# Altium project 3u.PrjPcb
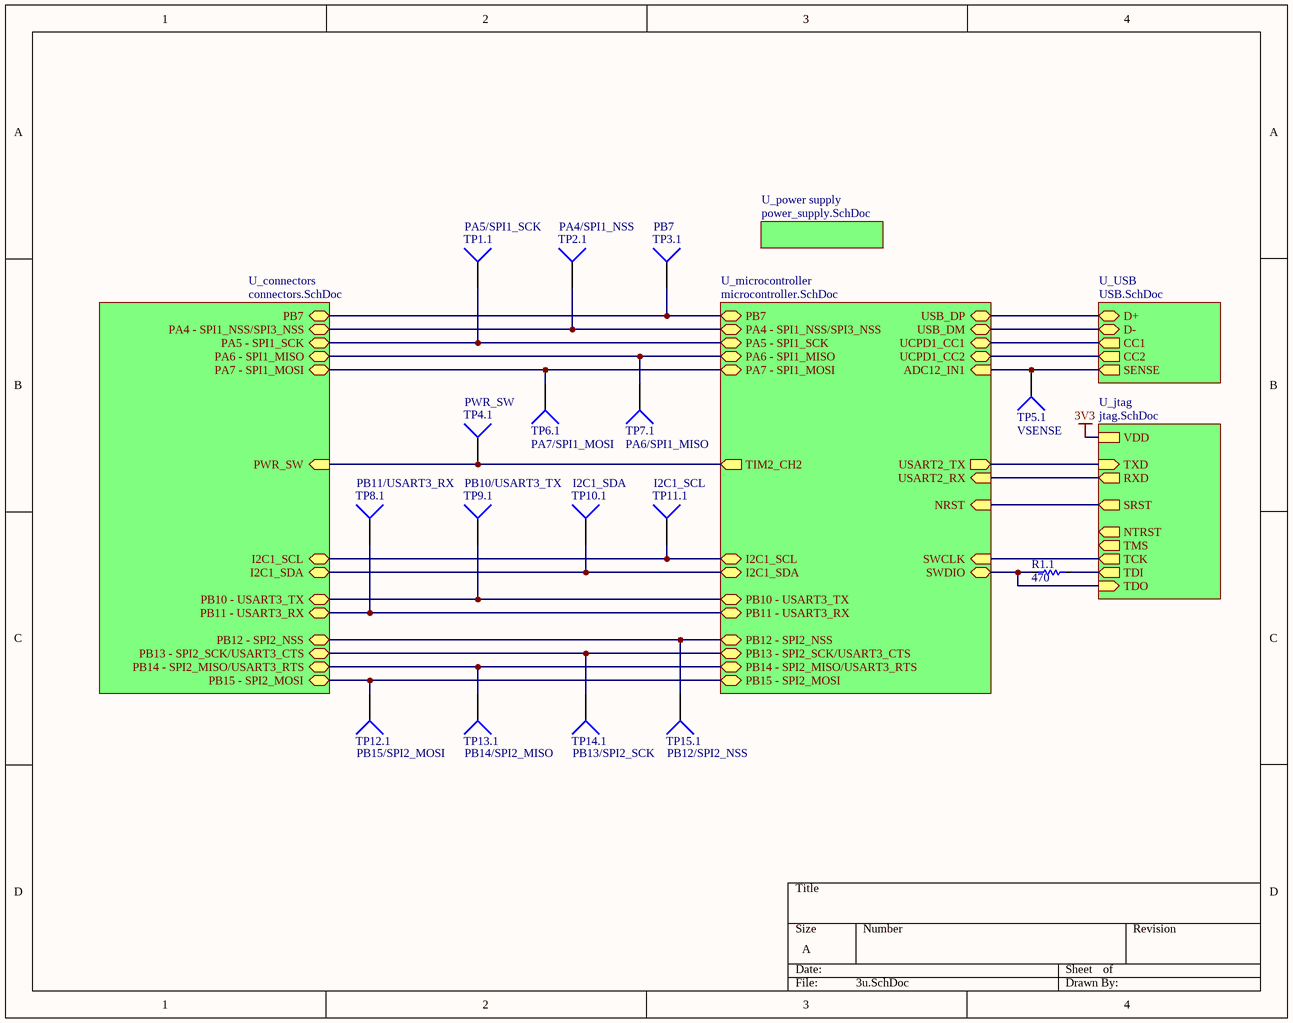
[diagram p0: 3u.SchDoc]
Assembly_Version: 1; PCB_Version: 0.1
7 sheets, 73 parts. Net scope: hierarchical (ports join the sheet entries above them; power ports are global).
Board file: 3u.PcbDoc
Sheets:
  3u.SchDoc
    U_power supply = power_supply.SchDoc
    U_microcontroller = microcontroller.SchDoc
    U_USB = USB.SchDoc
      U_current sensor = current_sensor.SchDoc
    U_jtag = jtag.SchDoc
    U_connectors = connectors.SchDoc

## Sheet 3u.SchDoc
size A

### Parts
R1.1  470  [0402]
TP1.1  PA5/SPI1_SCK  [Test Point Target 1mm]  (no BOM)
TP2.1  PA4/SPI1_NSS  [Test Point Target 1mm]  (no BOM)
TP3.1  PB7  [Test Point Target 1mm]  (no BOM)
TP4.1  PWR_SW  [Test Point Target 1mm]  (no BOM)
TP5.1  VSENSE  [Test Point Target 1mm]  (no BOM)
TP6.1  PA7/SPI1_MOSI  [Test Point Target 1mm]  (no BOM)
TP7.1  PA6/SPI1_MISO  [Test Point Target 1mm]  (no BOM)
TP8.1  PB11/USART3_RX  [Test Point Target 1mm]  (no BOM)
TP9.1  PB10/USART3_TX  [Test Point Target 1mm]  (no BOM)
TP10.1  I2C1_SDA  [Test Point Target 1mm]  (no BOM)
TP11.1  I2C1_SCL  [Test Point Target 1mm]  (no BOM)
TP12.1  PB15/SPI2_MOSI  [Test Point Target 1mm]  (no BOM)
TP13.1  PB14/SPI2_MISO  [Test Point Target 1mm]  (no BOM)
TP14.1  PB13/SPI2_SCK  [Test Point Target 1mm]  (no BOM)
TP15.1  PB12/SPI2_NSS  [Test Point Target 1mm]  (no BOM)

### Sub-sheets
U_connectors = connectors.SchDoc: I2C1_SCL (bidir), PB12 - SPI2_NSS (bidir), PB15 - SPI2_MOSI (bidir), PB7 (bidir), PB10 - USART3_TX (bidir), PB11 - USART3_RX (bidir), PB13 - SPI2_SCK/USART3_CTS (bidir), PA7 - SPI1_MOSI (bidir), PB14 - SPI2_MISO/USART3_RTS (bidir), I2C1_SDA (bidir), PA6 - SPI1_MISO (bidir), PA5 - SPI1_SCK (bidir), PA4 - SPI1_NSS/SPI3_NSS (bidir), PWR_SW (in)
U_jtag = jtag.SchDoc: TDI (out), TMS (out), TCK (out), TDO (in), SRST (out), RXD (out), NTRST (out), TXD (in), VDD
U_microcontroller = microcontroller.SchDoc: NRST (in), I2C1_SDA (bidir), I2C1_SCL (bidir), USART2_TX (out), USART2_RX (in), USB_DM (bidir), USB_DP (bidir), UCPD1_CC1 (bidir), UCPD1_CC2 (bidir), SWDIO (bidir), SWCLK (in), ADC12_IN1 (in), PB11 - USART3_RX (bidir), PB15 - SPI2_MOSI (bidir), PB14 - SPI2_MISO/USART3_RTS (bidir), PB10 - USART3_TX (bidir), PB13 - SPI2_SCK/USART3_CTS (bidir), PB12 - SPI2_NSS (bidir), PA7 - SPI1_MOSI (bidir), PA6 - SPI1_MISO (bidir), PA5 - SPI1_SCK (bidir), PA4 - SPI1_NSS/SPI3_NSS (bidir), PB7 (bidir), TIM2_CH2 (out)
U_power supply = power_supply.SchDoc: no entries
U_USB = USB.SchDoc: D- (bidir), D+ (bidir), CC2 (out), CC1 (out), SENSE (out)

### Nets
I2C1_SCL: TP11.1.1 ; sheet U_microcontroller/I2C1_SCL, sheet U_connectors/I2C1_SCL
I2C1_SDA: TP10.1.1 ; sheet U_microcontroller/I2C1_SDA, sheet U_connectors/I2C1_SDA
UCPD1_CC1: sheet U_microcontroller/UCPD1_CC1, sheet U_USB/CC1
UCPD1_CC2: sheet U_microcontroller/UCPD1_CC2, sheet U_USB/CC2
NetD1.4_4: sheet U_microcontroller/USB_DM, sheet U_USB/D-
NetD1.4_6: sheet U_microcontroller/USB_DP, sheet U_USB/D+
NetP1.3_4: sheet U_microcontroller/SWCLK, sheet U_jtag/TCK
NetP1.3_5: sheet U_microcontroller/USART2_TX, sheet U_jtag/TXD
NetP1.3_6: R1.1.2 ; sheet U_microcontroller/SWDIO, sheet U_jtag/TDO
NetP1.3_8: R1.1.1 ; sheet U_jtag/TDI
NetP1.3_9: sheet U_microcontroller/USART2_RX, sheet U_jtag/RXD
NetP1.3_10: sheet U_microcontroller/NRST, sheet U_jtag/SRST
NetP1.7_3: TP3.1.1 ; sheet U_microcontroller/PB7, sheet U_connectors/PB7
NetP1.7_4: TP2.1.1 ; sheet U_microcontroller/PA4 - SPI1_NSS/SPI3_NSS, sheet U_connectors/PA4 - SPI1_NSS/SPI3_NSS
NetP1.7_8: TP1.1.1 ; sheet U_microcontroller/PA5 - SPI1_SCK, sheet U_connectors/PA5 - SPI1_SCK
NetP1.7_12: TP7.1.1 ; sheet U_microcontroller/PA6 - SPI1_MISO, sheet U_connectors/PA6 - SPI1_MISO
NetP1.7_13: TP6.1.1 ; sheet U_microcontroller/PA7 - SPI1_MOSI, sheet U_connectors/PA7 - SPI1_MOSI
NetP2.7_6: TP9.1.1 ; sheet U_microcontroller/PB10 - USART3_TX, sheet U_connectors/PB10 - USART3_TX
NetP2.7_7: TP8.1.1 ; sheet U_microcontroller/PB11 - USART3_RX, sheet U_connectors/PB11 - USART3_RX
NetP2.7_9: TP15.1.1 ; sheet U_microcontroller/PB12 - SPI2_NSS, sheet U_connectors/PB12 - SPI2_NSS
NetP2.7_10: TP14.1.1 ; sheet U_microcontroller/PB13 - SPI2_SCK/USART3_CTS, sheet U_connectors/PB13 - SPI2_SCK/USART3_CTS
NetP2.7_13: TP13.1.1 ; sheet U_microcontroller/PB14 - SPI2_MISO/USART3_RTS, sheet U_connectors/PB14 - SPI2_MISO/USART3_RTS
NetP2.7_14: TP12.1.1 ; sheet U_microcontroller/PB15 - SPI2_MOSI, sheet U_connectors/PB15 - SPI2_MOSI
NetQ2.7_3: TP4.1.1 ; sheet U_microcontroller/TIM2_CH2, sheet U_connectors/PWR_SW
NetTP5.1_1: TP5.1.1 ; sheet U_microcontroller/ADC12_IN1, sheet U_USB/SENSE

### Library data of the parts
R1.1 = RESISTOR: Value: 470
TP1.1 TP2.1 TP3.1 TP4.1 TP5.1 TP6.1 TP7.1 TP8.1 TP9.1 TP10.1 TP11.1 TP12.1 TP13.1 TP14.1 TP15.1 = Socket: LatestRevisionDate: 17-Jul-2002; LatestRevisionNote: Re-released for DXP Platform.; Publisher: Altium Limited

## Sheet power_supply.SchDoc
size A
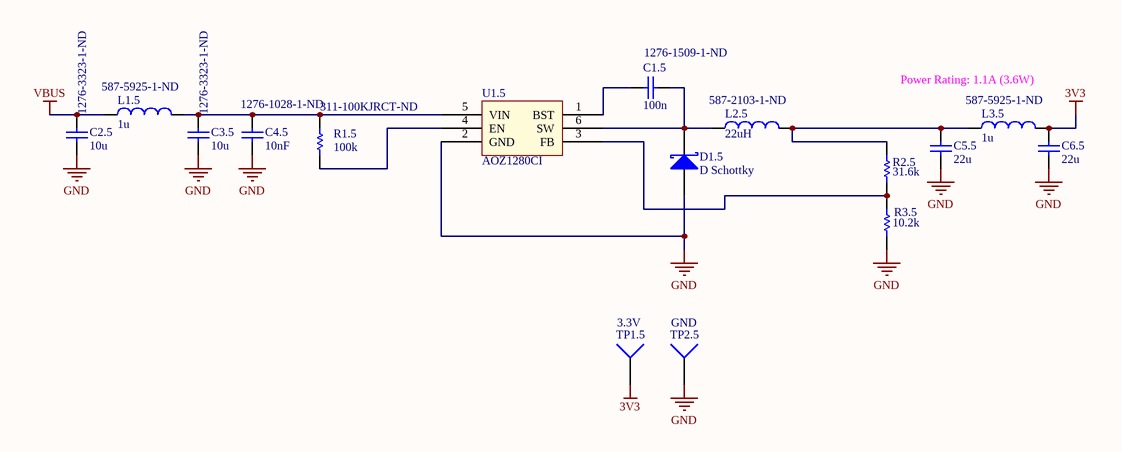
[diagram p1: power_supply.SchDoc]

### Parts
C1.5  Supplier Part Number 1: 1276-1509-1-ND  [0402]  (hidden comment: 100n)
C2.5  Supplier Part Number 1: 1276-3323-1-ND  [1210]  (hidden comment: 10u)
C3.5  Supplier Part Number 1: 1276-3323-1-ND  [1210]  (hidden comment: 10u)
C4.5  Supplier Part Number 1: 1276-1028-1-ND  [0402]  (hidden comment: 10nF)
C5.5  22u  [0805]
C6.5  22u  [0805]
D1.5  D Schottky  [DO-214AC]
L1.5  Supplier Part Number 1: 587-5925-1-ND  [0806]  (hidden comment: 1u)
L2.5  value 22uH  Supplier Part Number 1: 587-2103-1-ND  [Murata 2900]  (hidden comment: 33u)
L3.5  Supplier Part Number 1: 587-5925-1-ND  [0806]  (hidden comment: 1u)
R1.5  Supplier Part Number 1: 311-100KJRCT-ND  [0402]  (hidden comment: 100k)
R2.5  value 31.6k  [0402]  (hidden comment: 9.09k)
R3.5  value 10.2k  [0402]  (hidden comment: 9.09k)
TP1.5  3.3V  [Test Point Target 1mm]  (no BOM)
TP2.5  GND  [Test Point Target 1mm]  (no BOM)
U1.5  Manufacturer Part Number: AOZ1280CI  [MK06A_N]

### Nets
3V3: C6.5.2 L3.5.2 TP1.5.1
GND: C2.5.1 C3.5.1 C4.5.1 C5.5.1 C6.5.1 D1.5.A R3.5.1 TP2.5.1 U1.5.2(GND)
VBUS: C2.5.2 L1.5.1
NetC1.5_1: C1.5.1 U1.5.1(BST)
NetC1.5_2: C1.5.2 D1.5.K L2.5.1 U1.5.6(SW)
NetC3.5_2: C3.5.2 C4.5.2 L1.5.2 R1.5.2 U1.5.5(VIN)
NetC5.5_2: C5.5.2 L2.5.2 L3.5.1 R2.5.2
NetR1.5_1: R1.5.1 U1.5.4(EN)
NetR2.5_1: R2.5.1 R3.5.2 U1.5.3(FB)

### Notes on the sheet
- Power Rating: 1.1A (3.6W)

### Library data of the parts
C1.5 C4.5 = CAPACITOR NON_POL: Supplier 1: Digi-Key
  C1.5: Value: 100n
  C4.5: Value: 10nF
C2.5 C3.5 = CAPACITOR NON_POL: Material: Ceramic; Capacitance: 10uF; Tolerance: 10%; Dielectric: X7R; Voltage Rating: 35V; Value: 10u; ComponentLink1URL: http://www.murata.com/~/media/webrenewal/support/library/catalog/products/capacitor/mlcc/c02e.ashx; ComponentLink1Description: http://www.murata.com/~/media/webrenewal/support/library/catalog/products/capacitor/mlcc/c02e.ashx; Supplier 1: Digi-Key; Stock 1: 421732; Pricing 1: 1 = 0.81000, 10 = 0.57000, 100 = 0.37510, 500 = 0.27788, 1000 = 0.23619 (USD); RoHS: Yes; Mount: Surface Mount; Case/Package: 1210; Case Code (Metric): 3225; Case Code (Imperial): 1210; Min Operating Temperature: -55°C; Max Operating Temperature: 125°C; Package Quantity: 1; Packaging: Tape and Reel; Voltage: 35V; Length: 3.2mm; Height: 1.8mm; Depth: 2.5mm; Width: 0.098inch; Thickness: 0.079inch; Radiation Hardening: No; Lead Free: Lead Free; ComponentLink2URL: https://datasheet.ciiva.com/25724/cl32b106klulnne-25724000.pdf?src-supplier=Digi-Key; ComponentLink2Description: https://datasheet.ciiva.com/25724/cl32b106klulnne-25724000.pdf?src-supplier=Digi-Key; ComponentLink3URL: https://datasheet.ciiva.com/15196/getdatasheetpartid-353216-15196149.pdf?src-supplier=Verical; ComponentLink3Description: https://datasheet.ciiva.com/15196/getdatasheetpartid-353216-15196149.pdf?src-supplier=Verical; ComponentLink4URL: https://datasheet.ciiva.com/29202/450840-da-01-en-vs-kondensator-1210-29202828.pdf?src-supplier=Conrad; ComponentLink4Description: https://datasheet.ciiva.com/29202/450840-da-01-en-vs-kondensator-1210-29202828.pdf?src-supplier=Conrad
C5.5 C6.5 = CAPACITOR NON_POL: Manufacturer: Murata Electronics North America; Manufacturer Part Number: GRM21BR61A226ME44L; Capacitance: 22µF; Tolerance: ±20%; Voltage - Rated: 10V; Temperature Coefficient: X5R; Value: 22u; Supplier 1: Digi-Key; Supplier Part Number 1: 490-10746-1-ND; RoHS: RoHS Compliant; Category: Capacitors; Stock 1: 23435; Pricing 1: 1=0.48, 10=0.34, 100=0.2237, 1000=0.14082 (USD); Packaging: Cut Tape (CT); Part Status: Active; Operating Temperature: -55°C ~ 85°C; Features: -; Ratings: -; Applications: General Purpose; Mounting Type: Surface Mount, MLCC; Package / Case: 0805 (2012 Metric); Size / Dimension: 0.079" L x 0.049" W (2.00mm x 1.25mm); Height - Seated (Max): -; Thickness (Max): 0.057" (1.45mm); Lead Spacing: -; Lead Style: -; ComponentLink1URL: http://www.murata.com/~/media/webrenewal/support/library/catalog/products/capacitor/mlcc/c02e.ashx; ComponentLink1Description: http://www.murata.com/~/media/webrenewal/support/library/catalog/products/capacitor/mlcc/c02e.ashx
D1.5 = D Schottky: Schottky Diode; Manufacturer: Diodes Incorporated; Manufacturer Part Number: B240A-13-F; Current - Average Rectified (Io): 2A; Speed: Fast Recovery =< 500ns, > 200mA (Io); Capacitance @ Vr, F: 200pF @ 4V, 1MHz; Supplier 1: Digi-Key; Supplier Part Number 1: B240A-FDICT-ND; RoHS: RoHS Compliant; Category: Discrete Semiconductor Products; Stock 1: 244420; Pricing 1: 1=0.5, 10=0.38, 100=0.2368, 500=0.16202, 1000=0.12463 (USD); Packaging: Cut Tape (CT); Part Status: Active; Diode Type: Schottky; Mounting Type: Surface Mount; Package / Case: DO-214AC, SMA; Supplier Device Package: SMA; Operating Temperature - Junction: -65°C ~ 150°C; Base Part Number: B240; ComponentLink1URL: https://www.diodes.com/assets/Datasheets/ds13004.pdf; ComponentLink1Description: https://www.diodes.com/assets/Datasheets/ds13004.pdf
L1.5 L3.5 = Inductor: Manufacturer: Taiyo Yuden; Manufacturer Part Number: MAKK2016T1R0M; Type: Wirewound; Material - Core: Metal; Tolerance: ±20%; Current - Saturation: 2.2A; Shielding: Shielded; DC Resistance (DCR): 75 mOhm Max; Value: 1u; Supplier 1: Digi-Key; RoHS: RoHS Compliant; Category: Inductors, Coils, Chokes; Stock 1: 39611; Pricing 1: 1=0.23, 10=0.204, 100=0.1404, 500=0.12, 1000=0.09191 (USD); Packaging: Cut Tape (CT); Part Status: Active; Q @ Freq: -; Frequency - Self Resonant: -; Ratings: -; Operating Temperature: -40°C ~ 105°C; Mounting Type: Surface Mount; Package / Case: 0806 (2016 Metric); Supplier Device Package: 0806 (2016 Metric); Size / Dimension: 0.079" L x 0.063" W (2.00mm x 1.60mm); Height - Seated (Max): 0.039" (1.00mm); ComponentLink1URL: http://ds.yuden.co.jp/TYCOMPAS/ut/detail.do?productNo=MAKK2016T1R0M&fileName=MAKK2016T1R0M_SS&mode=specSheetDownload; ComponentLink1Description: http://ds.yuden.co.jp/TYCOMPAS/ut/detail.do?productNo=MAKK2016T1R0M&fileName=MAKK2016T1R0M_SS&mode=specSheetDownload
L2.5 = Inductor: Manufacturer: Murata Power Solutions Inc; Manufacturer Part Number: 29L104C; Code_IEC: 1005; Inductance: 100µH; Current: 480mA; Shielding: Shielded; DC Resistance (DCR): 456.0 mOhm Max; Frequency - Test: 10kHz; Current - Saturation: 1.1A; Current - Temperature Rise: 1.3A; Frequency - Self Resonant: 11MHz; Published: 8-Jun-2000; LatestRevisionDate: 29-May-2009; LatestRevisionNote: IPC-7351 Footprint Added.; PackageReference: 0402-A; Publisher: Altium Limited; PackageDescription: Chip Inductor; Code_JEITA: 0402; RoHS: RoHS Compliant; Category: Inductors, Coils, Chokes; Current Rating - Saturation: -; Current Rating - Temperature Rise: -; Type: -; Tolerance: -; Q @ Freq: -; Self Resonant Freq: -; Package / Case: 0.283" L x 0.283" W x 0.124" H (7.20mm x 7.20mm x 3.15mm); Mounting Type: Surface Mount; Packaging: Digi-Reel®; Operating Temperature: -40°C ~ 85°C; Core Material: -; Applications: EMI Filter; ComponentLink1URL: http://www.murata-ps.com/data/magnetics/kmp_2900l.pdf; ComponentLink1Description: http://www.murata-ps.com/data/magnetics/kmp_2900l.pdf; Material - Core: -; ComponentLink2URL: http://www.yuden.co.jp/ut/product/pdf/wound_i_all_e.pdf; ComponentLink2Description: http://www.yuden.co.jp/ut/product/pdf/wound_i_all_e.pdf; Supplier 1: Digi-Key; Stock 1: 12480; Pricing 1: 1=0.34, 10=0.316, 50=0.2962, 100=0.2765, 500=0.21726, 1000=0.17775, 2000=0.1185, 4000=0.11455, 6000=0.1106, 8000=0.10665, 10000=0.10152, 12000=0.09638 (USD); ComponentLink3URL: http://www.yuden.co.jp/cs/release/pdf/pdf_480.pdf; ComponentLink3Description: http://www.yuden.co.jp/cs/release/pdf/pdf_480.pdf
R1.5 = ERJ2GE: Value: 100k; Supplier 1: Digi-Key
R2.5 = ERJ2GE: Resistor; Manufacturer: Susumu; Manufacturer Part Number: RR0510P-3322-D; Note: If flow soldering, adjust pad width of PCB Footprint to 0.7 - 0.8 times the width of the resistor.; Resistance (Ohms): 33.2K; Power (Watts): 0.063W, 1/16W; Temperature Coefficient: ±25ppm/°C; Tolerance: ±0.5%; Published: 17-Dec-2003; LatestRevisionDate: 19-Mar-2004; LatestRevisionNote: Silkscreen size reduced.; PackageDocument: Mar-2003; PackageReference: 2-0402; Publisher: Altium Limited; Code_IPC: 1005 [0402]; ComponentLink1Description: Manufacturer Link; ComponentLink1URL: http://www.panasonic.com/industrial/components/resistive_products.htm; ComponentLink2Description: Datasheet; ComponentLink2URL: http://www.panasonic.com/industrial/components/pdf/AOA0000CE1.pdf; RoHS: RoHS Compliant; Composition: Thin Film; Features: -; Size / Dimension: 0.039" L x 0.020" W (1.00mm x 0.50mm); Height: 0.016" (0.40mm); Number of Terminations: 2; Packaging: Cut Tape (CT); Package / Case: 0402 (1005 Metric); ComponentLink3URL: http://www.susumu-usa.com/pdf/products_12.pdf; ComponentLink3Description: http://www.susumu-usa.com/pdf/products_12.pdf; Supplier 1: Digi-Key; Supplier Part Number 1: RMCF0402FT31K6CT-ND; Stock 1: 54086; Pricing 1: 1=0.04, 10=0.025, 50=0.0138, 100=0.0105, 250=0.0078, 500=0.00576, 1000=0.00384 (USD); ComponentLink4URL: http://www.seielect.com/Catalog/SEI-RMCF.pdf; ComponentLink4Description: http://www.seielect.com/Catalog/SEI-RMCF.pdf
R3.5 = ERJ2GE: Resistor; Manufacturer: Stackpole Electronics Inc; Manufacturer Part Number: RMCF0402FT14K3; Note: If flow soldering, adjust pad width of PCB Footprint to 0.7 - 0.8 times the width of the resistor.; Resistance (Ohms): 14.3K; Power (Watts): 0.063W, 1/16W; Temperature Coefficient: ±100ppm/°C; Tolerance: ±1%; Published: 17-Dec-2003; LatestRevisionDate: 19-Mar-2004; LatestRevisionNote: Silkscreen size reduced.; PackageDocument: Mar-2003; PackageReference: 2-0402; Publisher: Altium Limited; Code_IPC: 1005 [0402]; ComponentLink1Description: Manufacturer Link; ComponentLink1URL: http://www.panasonic.com/industrial/components/resistive_products.htm; ComponentLink2Description: Datasheet; ComponentLink2URL: http://www.panasonic.com/industrial/components/pdf/AOA0000CE1.pdf; RoHS: RoHS Compliant; Composition: Thick Film; Features: -; Size / Dimension: 0.039" L x 0.020" W (1.00mm x 0.50mm); Height: 0.016" (0.40mm); Number of Terminations: 2; Packaging: Cut Tape (CT); Package / Case: 0402 (1005 Metric); ComponentLink3URL: http://www.seielect.com/Catalog/SEI-RMCF.pdf; ComponentLink3Description: http://www.seielect.com/Catalog/SEI-RMCF.pdf; Supplier 1: Digi-Key; Supplier Part Number 1: RMCF0402FT10K2CT-ND; Stock 1: 8430; Pricing 1: 1=0.04, 10=0.025, 50=0.0138, 100=0.0105, 250=0.0078, 500=0.00576, 1000=0.00384 (USD)
TP1.5 TP2.5 = Socket: LatestRevisionDate: 17-Jul-2002; LatestRevisionNote: Re-released for DXP Platform.; Publisher: Altium Limited
U1.5 = ADP2300: IC BUCK ADJ 1.2A 6TSOT; Manufacturer: Alpha & Omega Semiconductor Inc.; Function: Step-Down; Output Configuration: Positive; Output Type: Adjustable; Number of Outputs: 1; Voltage - Input (Min): 3V; Voltage - Input (Max): 26V; Voltage - Output (Min/Fixed): 0.8V; Frequency - Switching: 1.5MHz; Synchronous Rectifier: No; Supplier 1: Digi-Key; Supplier Part Number 1: 785-1277-1-ND; RoHS: RoHS Compliant; Category: Integrated Circuits (ICs); Stock 1: 404776; Pricing 1: 1=0.7, 10=0.613, 25=0.5428, 100=0.4728, 250=0.41148, 500=0.3502, 1000=0.28016 (USD); Packaging: Cut Tape (CT); Part Status: Active; Topology: Buck; Voltage - Output (Max): 26V; Current - Output: 1.2A; Operating Temperature: -40°C ~ 85°C (TA); Mounting Type: Surface Mount; Package / Case: SOT-23-6; Supplier Device Package: SOT-23-6; ComponentLink1URL: http://aosmd.com/res/data_sheets/AOZ1280CI.pdf; ComponentLink1Description: http://aosmd.com/res/data_sheets/AOZ1280CI.pdf

## Sheet microcontroller.SchDoc
size A
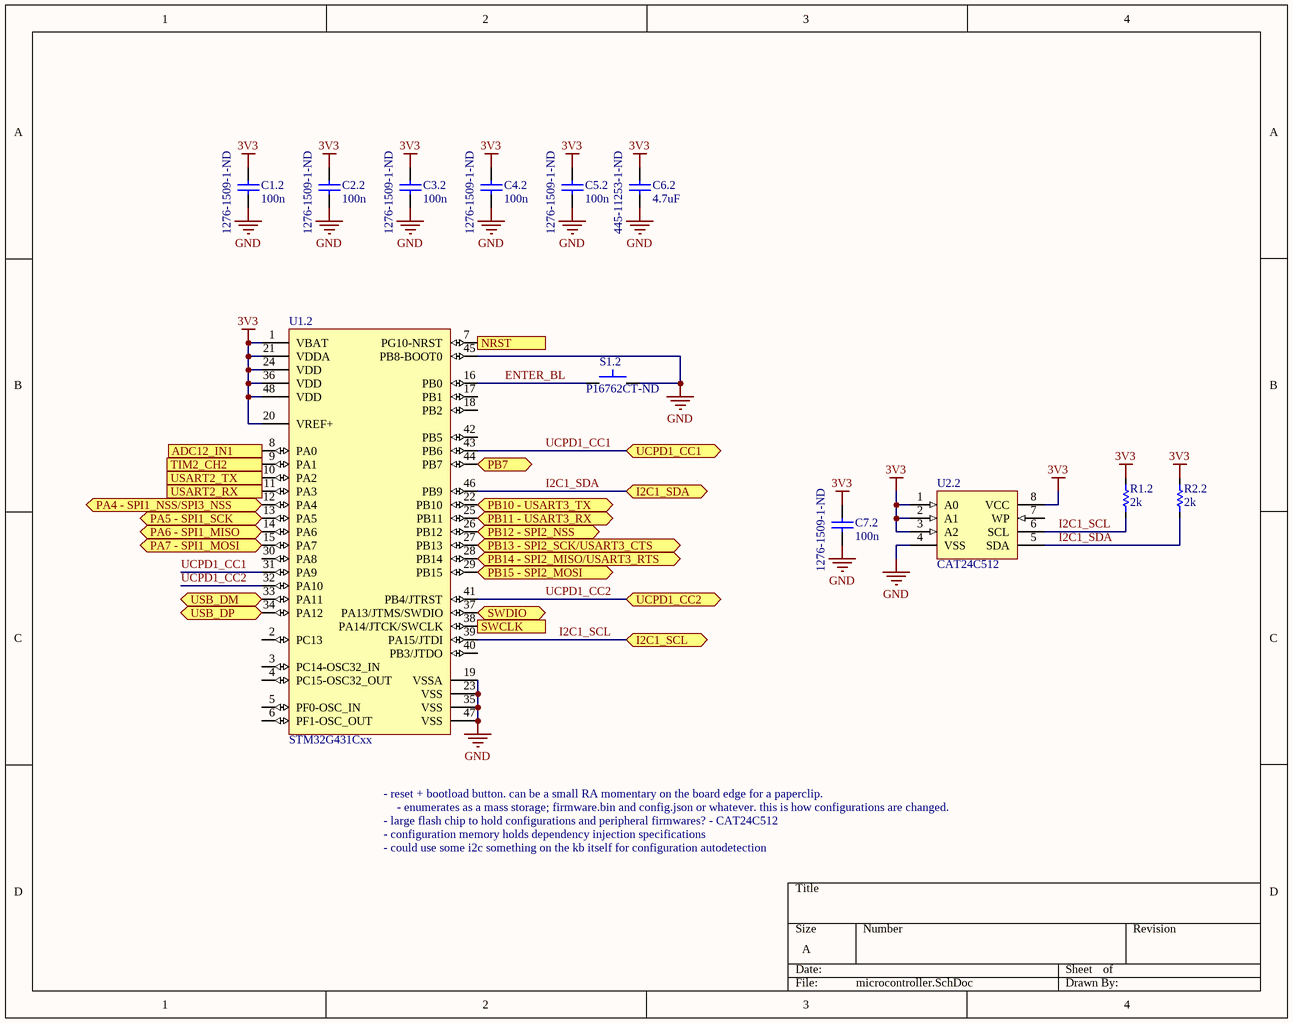
[diagram p2: microcontroller.SchDoc]

### Parts
C1.2  Supplier Part Number 1: 1276-1509-1-ND  [0402]  (hidden comment: 100n)
C2.2  Supplier Part Number 1: 1276-1509-1-ND  [0402]  (hidden comment: 100n)
C3.2  Supplier Part Number 1: 1276-1509-1-ND  [0402]  (hidden comment: 100n)
C4.2  Supplier Part Number 1: 1276-1509-1-ND  [0402]  (hidden comment: 100n)
C5.2  Supplier Part Number 1: 1276-1509-1-ND  [0402]  (hidden comment: 100n)
C6.2  4.7uF  Supplier Part Number 1: 445-11253-1-ND  [1608[0603]]
C7.2  Supplier Part Number 1: 1276-1509-1-ND  [0402]  (hidden comment: 100n)
R1.2  2k  [0402]
R2.2  2k  [0402]
S1.2  Supplier Part Number 1: P16762CT-ND  [EVQ-P6D/P]  (hidden comment: MOM_SWITCH)
U1.2  STM32G431Cxx  [TSQFP50P900X900X160-48N]
U2.2  CAT24C512  [TSOP65P640X120-8N]

### Ports
ADC12_IN1 (in), I2C1_SCL (bidir), I2C1_SDA (bidir), NRST (in), PA4 - SPI1_NSS/SPI3_NSS (bidir), PA5 - SPI1_SCK (bidir), PA6 - SPI1_MISO (bidir), PA7 - SPI1_MOSI (bidir), PB7 (bidir), PB10 - USART3_TX (bidir), PB11 - USART3_RX (bidir), PB12 - SPI2_NSS (bidir), PB13 - SPI2_SCK/USART3_CTS (bidir), PB14 - SPI2_MISO/USART3_RTS (bidir), PB15 - SPI2_MOSI (bidir), SWCLK (in), SWDIO (bidir), TIM2_CH2 (out), UCPD1_CC1 (bidir), UCPD1_CC2 (bidir), USART2_RX (in), USART2_TX (out), USB_DM (bidir), USB_DP (bidir)

### Nets
3V3: C1.2.1 C2.2.1 C3.2.1 C4.2.1 C5.2.1 C6.2.2 C7.2.1 R1.2.2 R2.2.2 U1.2.1(VBAT) U1.2.20(VREF+) U1.2.21(VDDA) U1.2.24(VDD) U1.2.36(VDD) U1.2.48(VDD) U2.2.1(A0) U2.2.2(A1) U2.2.3(A2) U2.2.8(VCC)
GND: C1.2.2 C2.2.2 C3.2.2 C4.2.2 C5.2.2 C6.2.1 C7.2.2 S1.2.2 U1.2.19(VSSA) U1.2.23(VSS) U1.2.35(VSS) U1.2.45(PB8-BOOT0) U1.2.47(VSS) U2.2.4(VSS)
ENTER_BL: S1.2.1 U1.2.16(PB0)
I2C1_SCL: R1.2.1 U1.2.39(PA15/JTDI) U2.2.6(SCL) ; port I2C1_SCL
I2C1_SDA: R2.2.1 U1.2.46(PB9) U2.2.5(SDA) ; port I2C1_SDA
UCPD1_CC1: U1.2.31(PA9) U1.2.43(PB6) ; port UCPD1_CC1
UCPD1_CC2: U1.2.32(PA10) U1.2.41(PB4/JTRST) ; port UCPD1_CC2
NetD1.4_4: U1.2.33(PA11) ; port USB_DM
NetD1.4_6: U1.2.34(PA12) ; port USB_DP
NetP1.3_4: U1.2.38(PA14/JTCK/SWCLK) ; port SWCLK
NetP1.3_5: U1.2.10(PA2) ; port USART2_TX
NetP1.3_6: U1.2.37(PA13/JTMS/SWDIO) ; port SWDIO
NetP1.3_9: U1.2.11(PA3) ; port USART2_RX
NetP1.3_10: U1.2.7(PG10-NRST) ; port NRST
NetP1.7_3: U1.2.44(PB7) ; port PB7
NetP1.7_4: U1.2.12(PA4) ; port PA4 - SPI1_NSS/SPI3_NSS
NetP1.7_8: U1.2.13(PA5) ; port PA5 - SPI1_SCK
NetP1.7_12: U1.2.14(PA6) ; port PA6 - SPI1_MISO
NetP1.7_13: U1.2.15(PA7) ; port PA7 - SPI1_MOSI
NetP2.7_6: U1.2.22(PB10) ; port PB10 - USART3_TX
NetP2.7_7: U1.2.25(PB11) ; port PB11 - USART3_RX
NetP2.7_9: U1.2.26(PB12) ; port PB12 - SPI2_NSS
NetP2.7_10: U1.2.27(PB13) ; port PB13 - SPI2_SCK/USART3_CTS
NetP2.7_13: U1.2.28(PB14) ; port PB14 - SPI2_MISO/USART3_RTS
NetP2.7_14: U1.2.29(PB15) ; port PB15 - SPI2_MOSI
NetQ2.7_3: U1.2.9(PA1) ; port TIM2_CH2
NetTP5.1_1: U1.2.8(PA0) ; port ADC12_IN1

Not connected (* = marked no-connect by the designer): U1.2 2(PC13) 3(PC14-OSC32_IN) 4(PC15-OSC32_OUT) 5(PF0-OSC_IN) 6(PF1-OSC_OUT) 17(PB1) 18(PB2) 30(PA8) 40(PB3/JTDO) 42(PB5); U2.2 7(WP)

### Notes on the sheet
- - reset + bootload button. can be a small RA momentary on the board edge for a paperclip.
- - large flash chip to hold configurations and peripheral firmwares? - CAT24C512
- - configuration memory holds dependency injection specifications
- - enumerates as a mass storage; firmware.bin and config.json or whatever. this is how configurations are changed.
- - could use some i2c something on the kb itself for configuration autodetection

### Library data of the parts
C1.2 C2.2 C3.2 C4.2 C5.2 C7.2 = CAPACITOR NON_POL: Value: 100n; Supplier 1: Digi-Key
C6.2 = C0402: Value: 4.7uF; Supplier 1: Digi-Key
R1.2 R2.2 = RESISTOR: Manufacturer: Yageo; Manufacturer Part Number: RC0402JR-072KL; Tolerance: ±5%; Power (Watts): 0.063W, 1/16W; Temperature Coefficient: ±100ppm/°C; Value: 2k; Supplier 1: Digi-Key; Supplier Part Number 1: 311-2.0KJRCT-ND; Pricing 1: 1=0.1, 10=0.012, 25=0.0084, 100=0.0047, 250=0.0036, 500=0.0029, 1000=0.00213, 2500=0.00185, 5000=0.00153 (USD); Packaging: Cut Tape (CT); Resistance (Ohms): 2k; Composition: Thick Film; Features: Moisture Resistant; Operating Temperature: -55°C ~ 155°C; Package / Case: 0402 (1005 Metric); Supplier Device Package: 0402; Size / Dimension: 0.039" L x 0.020" W (1.00mm x 0.50mm); Height: 0.016" (0.40mm); Number of Terminations: 2; ComponentLink1URL: http://www.yageo.com/documents/recent/PYu-RC_Group_51_RoHS_L_04.pdf; ComponentLink1Description: http://www.yageo.com/documents/recent/PYu-RC_Group_51_RoHS_L_04.pdf
S1.2 = MOM_SWITCH: Momentary switch; Supplier 1: Digi-Key

## Sheet USB.SchDoc
size A
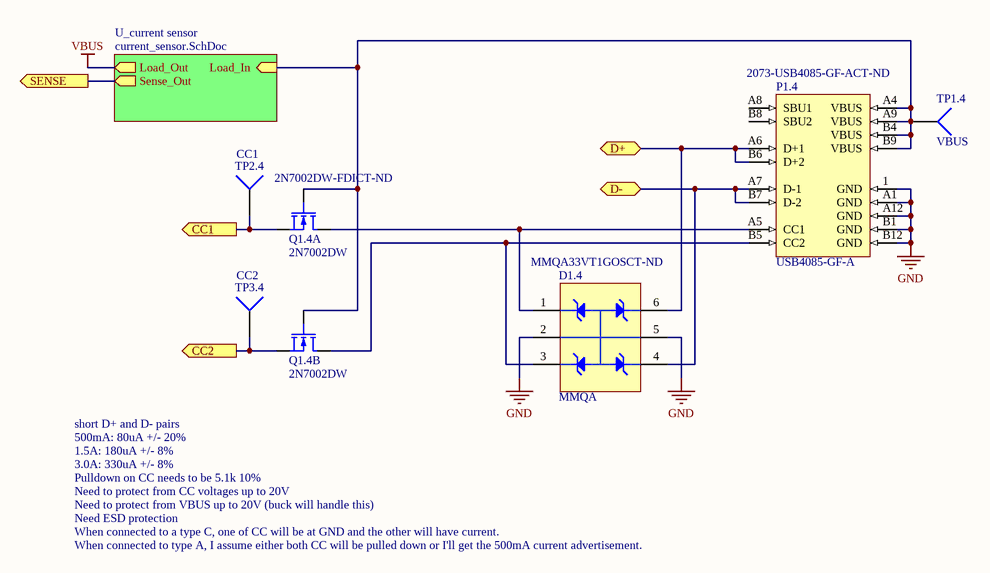
[diagram p3: USB.SchDoc]

### Parts
D1.4  MMQA  Supplier Part Number 1: MMQA33VT1GOSCT-ND  [SC-74]
P1.4  USB4085-GF-A  Supplier Part Number 1: 2073-USB4085-GF-ACT-ND  [USB4085-GF-A]
Q1.4  2N7002DW  Supplier Part Number 1: 2N7002DW-FDICT-ND  [SOT65P210X110-6N]  (parts A,B of 2)
TP1.4  VBUS  [Test Point Target 1mm]  (no BOM)
TP2.4  CC1  [Test Point Target 1mm]  (no BOM)
TP3.4  CC2  [Test Point Target 1mm]  (no BOM)

### Sub-sheets
U_current sensor = current_sensor.SchDoc: Load_In (in), Load_Out (out), Sense_Out (out)

### Ports
CC1 (out), CC2 (out), D+ (bidir), D- (bidir), SENSE (out)

### Nets
GND: D1.4.2 D1.4.5 P1.4.1(GND) P1.4.A1(GND) P1.4.A12(GND) P1.4.B1(GND) P1.4.B12(GND)
UCPD1_CC1: Q1.4.4(S) TP2.4.1 ; port CC1
UCPD1_CC2: Q1.4.1(S) TP3.4.1 ; port CC2
NetD1.4_1: D1.4.1 P1.4.A5(CC1) Q1.4.3(D)
NetD1.4_3: D1.4.3 P1.4.B5(CC2) Q1.4.6(D)
NetD1.4_4: D1.4.4 P1.4.A7(D-1) P1.4.B7(D-2) ; port D-
NetD1.4_6: D1.4.6 P1.4.A6(D+1) P1.4.B6(D+2) ; port D+
NetP1.4_A4: P1.4.A4(VBUS) P1.4.A9(VBUS) P1.4.B4(VBUS) P1.4.B9(VBUS) Q1.4.2(G) Q1.4.5(G) TP1.4.1 ; sheet U_current sensor/Load_In
NetTP5.1_1: port SENSE, sheet U_current sensor/Sense_Out

Not connected (* = marked no-connect by the designer): P1.4 A8(SBU1) B8(SBU2)

### Notes on the sheet
- short D+ and D- pairs
- Need to protect from CC voltages up to 20V
- 500mA: 80uA +/- 20%
- 1.5A: 180uA +/- 8%
- 3.0A: 330uA +/- 8%
- Pulldown on CC needs to be 5.1k 10%
- Need to protect from VBUS up to 20V (buck will handle this)
- When connected to a type C, one of CC will be at GND and the other will have current.
- When connected to type A, I assume either both CC will be pulled down or I'll get the 500mA current advertisement.
- Need ESD protection

### Library data of the parts
P1.4 = USB4085-GF-A: USB C Connector; Supplier 1: Digi-Key
TP1.4 TP2.4 TP3.4 = Socket: LatestRevisionDate: 17-Jul-2002; LatestRevisionNote: Re-released for DXP Platform.; Publisher: Altium Limited
D1.4 = MMQA: Supplier 1: Digi-Key
Q1.4 = 2N7002DW: Supplier 1: Digi-Key

## Sheet current_sensor.SchDoc
size A
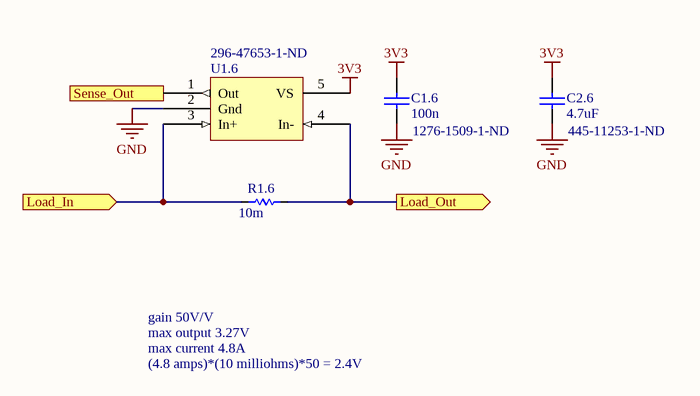
[diagram p4: current_sensor.SchDoc]

### Parts
C1.6  Supplier Part Number 1: 1276-1509-1-ND  [0402]  (hidden comment: 100n)
C2.6  4.7uF  Supplier Part Number 1: 445-11253-1-ND  [1608[0603]]
R1.6  10m  [0805]
U1.6  Supplier Part Number 1: 296-47653-1-ND  [SOT23-5]

### Ports
Load_In (in), Load_Out (out), Sense_Out (out)

### Nets
3V3: C1.6.1 C2.6.2 U1.6.5(VS)
GND: C1.6.2 C2.6.1 U1.6.2(Gnd)
VBUS: R1.6.1 U1.6.4(In-) ; port Load_Out
NetP1.4_A4: R1.6.2 U1.6.3(In+) ; port Load_In
NetTP5.1_1: U1.6.1(Out) ; port Sense_Out

### Notes on the sheet
- gain 50V/V
- max output 3.27V
- max current 4.8A
- (4.8 amps)*(10 milliohms)*50 = 2.4V

### Library data of the parts
C1.6 = CAPACITOR NON_POL: Value: 100n; Supplier 1: Digi-Key
C2.6 = C0402: derates to 2.2; Value: 4.7uF; Supplier 1: Digi-Key
R1.6 = RESISTOR: ComponentLink1URL: http://www.susumu.co.jp/common/pdf/n_catalog_partition09_en.pdf; ComponentLink1Description: http://www.susumu.co.jp/common/pdf/n_catalog_partition09_en.pdf; ComponentLink2URL: http://uk.rs-online.com/webdocs/1107/0900766b81107548.pdf?src-supplier=RSComponents; ComponentLink2Description: http://uk.rs-online.com/webdocs/1107/0900766b81107548.pdf?src-supplier=RSComponents; Value: 10m
U1.6 = INA180: Current Sense Amp; ComponentLink1URL: http://www.ti.com/lit/ds/symlink/ina180.pdf; ComponentLink1Description: http://www.ti.com/lit/ds/symlink/ina180.pdf; Supplier 1: Digi-Key

## Sheet jtag.SchDoc
size A
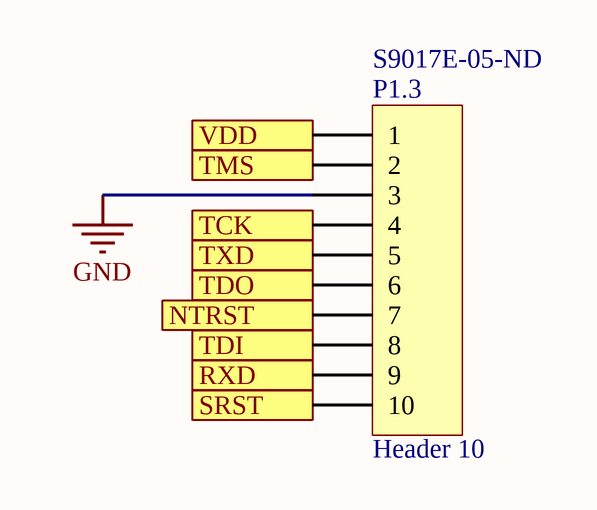
[diagram p5: jtag.SchDoc]

### Parts
P1.3  Header 10  Supplier Part Number 1: S9017E-05-ND  [GRPB052MWCN-RC]

### Ports
NTRST (out), RXD (out), SRST (out), TCK (out), TDI (out), TDO (in), TMS (out), TXD (in), VDD

### Nets
3V3: P1.3.1 ; port VDD
GND: P1.3.3
NetP1.3_2: P1.3.2 ; port TMS
NetP1.3_4: P1.3.4 ; port TCK
NetP1.3_5: P1.3.5 ; port TXD
NetP1.3_6: P1.3.6 ; port TDO
NetP1.3_7: P1.3.7 ; port NTRST
NetP1.3_8: P1.3.8 ; port TDI
NetP1.3_9: P1.3.9 ; port RXD
NetP1.3_10: P1.3.10 ; port SRST

### Library data of the parts
P1.3 = Header 10: Header, 10-Pin; ComponentLink1URL: http://cnctech.us/pdfs/3220-XX-0100-00.pdf; ComponentLink1Description: http://cnctech.us/pdfs/3220-XX-0100-00.pdf; Supplier 1: Digi-Key

## Sheet connectors.SchDoc
size A
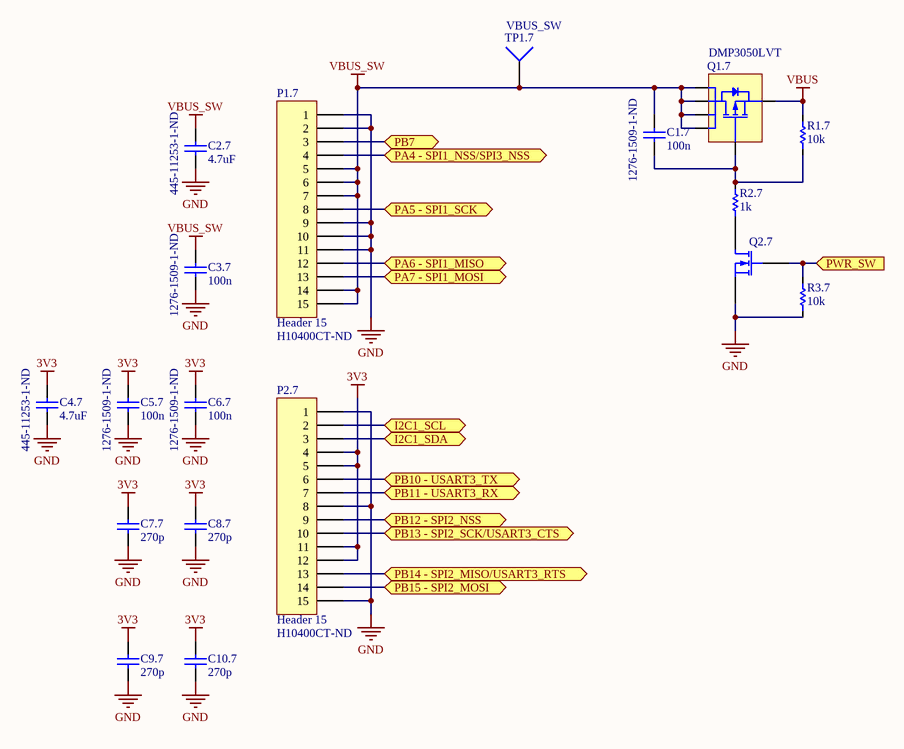
[diagram p6: connectors.SchDoc]

### Parts
C1.7  Supplier Part Number 1: 1276-1509-1-ND  [0402]  (hidden comment: 100n)
C2.7  4.7uF  Supplier Part Number 1: 445-11253-1-ND  [1608[0603]]
C3.7  Supplier Part Number 1: 1276-1509-1-ND  [0402]  (hidden comment: 100n)
C4.7  4.7uF  Supplier Part Number 1: 445-11253-1-ND  [1608[0603]]
C5.7  Supplier Part Number 1: 1276-1509-1-ND  [0402]  (hidden comment: 100n)
C6.7  Supplier Part Number 1: 1276-1509-1-ND  [0402]  (hidden comment: 100n)
C7.7  270p  [0402]
C8.7  270p  [0402]
C9.7  270p  [0402]
C10.7  270p  [0402]
P1.7  Header 15  Supplier Part Number 1: H10400CT-ND  [DF9-15S-1V]
P2.7  Header 15  Supplier Part Number 1: H10400CT-ND  [DF9-15S-1V]
Q1.7  DMP3050LVT  [SOT95P280X100-6N]
Q2.7  2N7002  [SOT23]  (value not drawn)
R1.7  10k  [0402]
R2.7  1k  [0402]
R3.7  10k  [0402]
TP1.7  VBUS_SW  [Test Point Target 1mm]  (no BOM)

### Ports
I2C1_SCL (bidir), I2C1_SDA (bidir), PA4 - SPI1_NSS/SPI3_NSS (bidir), PA5 - SPI1_SCK (bidir), PA6 - SPI1_MISO (bidir), PA7 - SPI1_MOSI (bidir), PB7 (bidir), PB10 - USART3_TX (bidir), PB11 - USART3_RX (bidir), PB12 - SPI2_NSS (bidir), PB13 - SPI2_SCK/USART3_CTS (bidir), PB14 - SPI2_MISO/USART3_RTS (bidir), PB15 - SPI2_MOSI (bidir), PWR_SW (in)

### Nets
3V3: C4.7.2 C5.7.1 C6.7.1 C7.7.2 C8.7.2 C9.7.2 C10.7.2 P2.7.4 P2.7.5 P2.7.11 P2.7.12
GND: C2.7.1 C3.7.2 C4.7.1 C5.7.2 C6.7.2 C7.7.1 C8.7.1 C9.7.1 C10.7.1 P1.7.1 P1.7.2 P1.7.9 P1.7.10 P1.7.11 P2.7.1 P2.7.8 P2.7.15 Q2.7.2(S) R3.7.1
VBUS: Q1.7.4(S) R1.7.2
VBUS_SW: C1.7.1 C2.7.2 C3.7.1 P1.7.5 P1.7.6 P1.7.7 P1.7.14 P1.7.15 Q1.7.1(D) Q1.7.2(D) Q1.7.5(D) Q1.7.6(D) TP1.7.1
I2C1_SCL: P2.7.2 ; port I2C1_SCL
I2C1_SDA: P2.7.3 ; port I2C1_SDA
NetC1.7_2: C1.7.2 Q1.7.3(G) R1.7.1 R2.7.2
NetP1.7_3: P1.7.3 ; port PB7
NetP1.7_4: P1.7.4 ; port PA4 - SPI1_NSS/SPI3_NSS
NetP1.7_8: P1.7.8 ; port PA5 - SPI1_SCK
NetP1.7_12: P1.7.12 ; port PA6 - SPI1_MISO
NetP1.7_13: P1.7.13 ; port PA7 - SPI1_MOSI
NetP2.7_6: P2.7.6 ; port PB10 - USART3_TX
NetP2.7_7: P2.7.7 ; port PB11 - USART3_RX
NetP2.7_9: P2.7.9 ; port PB12 - SPI2_NSS
NetP2.7_10: P2.7.10 ; port PB13 - SPI2_SCK/USART3_CTS
NetP2.7_13: P2.7.13 ; port PB14 - SPI2_MISO/USART3_RTS
NetP2.7_14: P2.7.14 ; port PB15 - SPI2_MOSI
NetQ2.7_1: Q2.7.1(D) R2.7.1
NetQ2.7_3: Q2.7.3(G) R3.7.2 ; port PWR_SW

### Library data of the parts
C1.7 C3.7 C5.7 C6.7 C7.7 C8.7 C9.7 C10.7 = CAPACITOR NON_POL
  C1.7 C3.7 C5.7 C6.7: Value: 100n; Supplier 1: Digi-Key
  C7.7 C8.7 C9.7 C10.7: Value: 270p
C2.7 C4.7 = C0402: Value: 4.7uF; Supplier 1: Digi-Key
P1.7 P2.7 = Header 15: Header, 15-Pin; LatestRevisionDate: 17-Jul-2002; LatestRevisionNote: Re-released for DXP Platform.; Publisher: Altium Limited; Supplier 1: Digi-Key
Q2.7 = 2N7002: N-Channel Enhancement Mode Vertical DMOS FET; Supplier 1: Digi-Key; Supplier Part Number 1: 2N7002-TPMSCT-ND
R1.7 R3.7 = RESISTOR: Manufacturer: Yageo; Manufacturer Part Number: RC0402JR-0710KL; Tolerance: ±5%; Power (Watts): 0.063W, 1/16W; Temperature Coefficient: ±100ppm/°C; Value: 10k; Supplier 1: Digi-Key; Supplier Part Number 1: 311-10KJRCT-ND; Pricing 1: 1=0.1, 10=0.012, 25=0.0084, 100=0.0047, 250=0.0036, 500=0.0029, 1000=0.00213, 2500=0.00185, 5000=0.00153 (USD); Packaging: Cut Tape (CT); Resistance (Ohms): 10k; Composition: Thick Film; Features: Moisture Resistant; Operating Temperature: -55°C ~ 155°C; Package / Case: 0402 (1005 Metric); Supplier Device Package: 0402; Size / Dimension: 0.039" L x 0.020" W (1.00mm x 0.50mm); Height: 0.016" (0.40mm); Number of Terminations: 2; ComponentLink1URL: http://www.yageo.com/documents/recent/PYu-RC_Group_51_RoHS_L_04.pdf; ComponentLink1Description: http://www.yageo.com/documents/recent/PYu-RC_Group_51_RoHS_L_04.pdf
R2.7 = RESISTOR: Value: 1k
TP1.7 = Socket: LatestRevisionDate: 17-Jul-2002; LatestRevisionNote: Re-released for DXP Platform.; Publisher: Altium Limited

## Nets that join several sheets
3V3: power_supply (C6.5.2 L3.5.2 TP1.5.1), microcontroller (19 pins), current_sensor (C1.6.1 C2.6.2 U1.6.5), jtag (P1.3.1), connectors (11 pins)
GND: power_supply (9 pins), microcontroller (14 pins), USB (7 pins), current_sensor (C1.6.2 C2.6.1 U1.6.2), jtag (P1.3.3), connectors (19 pins)
VBUS: power_supply (C2.5.2 L1.5.1), current_sensor (R1.6.1 U1.6.4), connectors (Q1.7.4 R1.7.2)
I2C1_SCL: 3u (TP11.1.1), microcontroller (R1.2.1 U1.2.39 U2.2.6), connectors (P2.7.2)
I2C1_SDA: 3u (TP10.1.1), microcontroller (R2.2.1 U1.2.46 U2.2.5), connectors (P2.7.3)
NetD1.4_4: microcontroller (U1.2.33), USB (D1.4.4 P1.4.A7 P1.4.B7)
NetD1.4_6: microcontroller (U1.2.34), USB (D1.4.6 P1.4.A6 P1.4.B6)
NetP1.3_4: microcontroller (U1.2.38), jtag (P1.3.4)
NetP1.3_5: microcontroller (U1.2.10), jtag (P1.3.5)
NetP1.3_6: 3u (R1.1.2), microcontroller (U1.2.37), jtag (P1.3.6)
NetP1.3_8: 3u (R1.1.1), jtag (P1.3.8)
NetP1.3_9: microcontroller (U1.2.11), jtag (P1.3.9)
NetP1.3_10: microcontroller (U1.2.7), jtag (P1.3.10)
NetP1.4_A4: USB (7 pins), current_sensor (R1.6.2 U1.6.3)
NetP1.7_3: 3u (TP3.1.1), microcontroller (U1.2.44), connectors (P1.7.3)
NetP1.7_4: 3u (TP2.1.1), microcontroller (U1.2.12), connectors (P1.7.4)
NetP1.7_8: 3u (TP1.1.1), microcontroller (U1.2.13), connectors (P1.7.8)
NetP1.7_12: 3u (TP7.1.1), microcontroller (U1.2.14), connectors (P1.7.12)
NetP1.7_13: 3u (TP6.1.1), microcontroller (U1.2.15), connectors (P1.7.13)
NetP2.7_6: 3u (TP9.1.1), microcontroller (U1.2.22), connectors (P2.7.6)
NetP2.7_7: 3u (TP8.1.1), microcontroller (U1.2.25), connectors (P2.7.7)
NetP2.7_9: 3u (TP15.1.1), microcontroller (U1.2.26), connectors (P2.7.9)
NetP2.7_10: 3u (TP14.1.1), microcontroller (U1.2.27), connectors (P2.7.10)
NetP2.7_13: 3u (TP13.1.1), microcontroller (U1.2.28), connectors (P2.7.13)
NetP2.7_14: 3u (TP12.1.1), microcontroller (U1.2.29), connectors (P2.7.14)
NetQ2.7_3: 3u (TP4.1.1), microcontroller (U1.2.9), connectors (Q2.7.3 R3.7.2)
NetTP5.1_1: 3u (TP5.1.1), microcontroller (U1.2.8), current_sensor (U1.6.1)
UCPD1_CC1: microcontroller (U1.2.31 U1.2.43), USB (Q1.4.4 TP2.4.1)
UCPD1_CC2: microcontroller (U1.2.32 U1.2.41), USB (Q1.4.1 TP3.4.1)